# Altium schematic sheet in_board.SchDoc
size A2
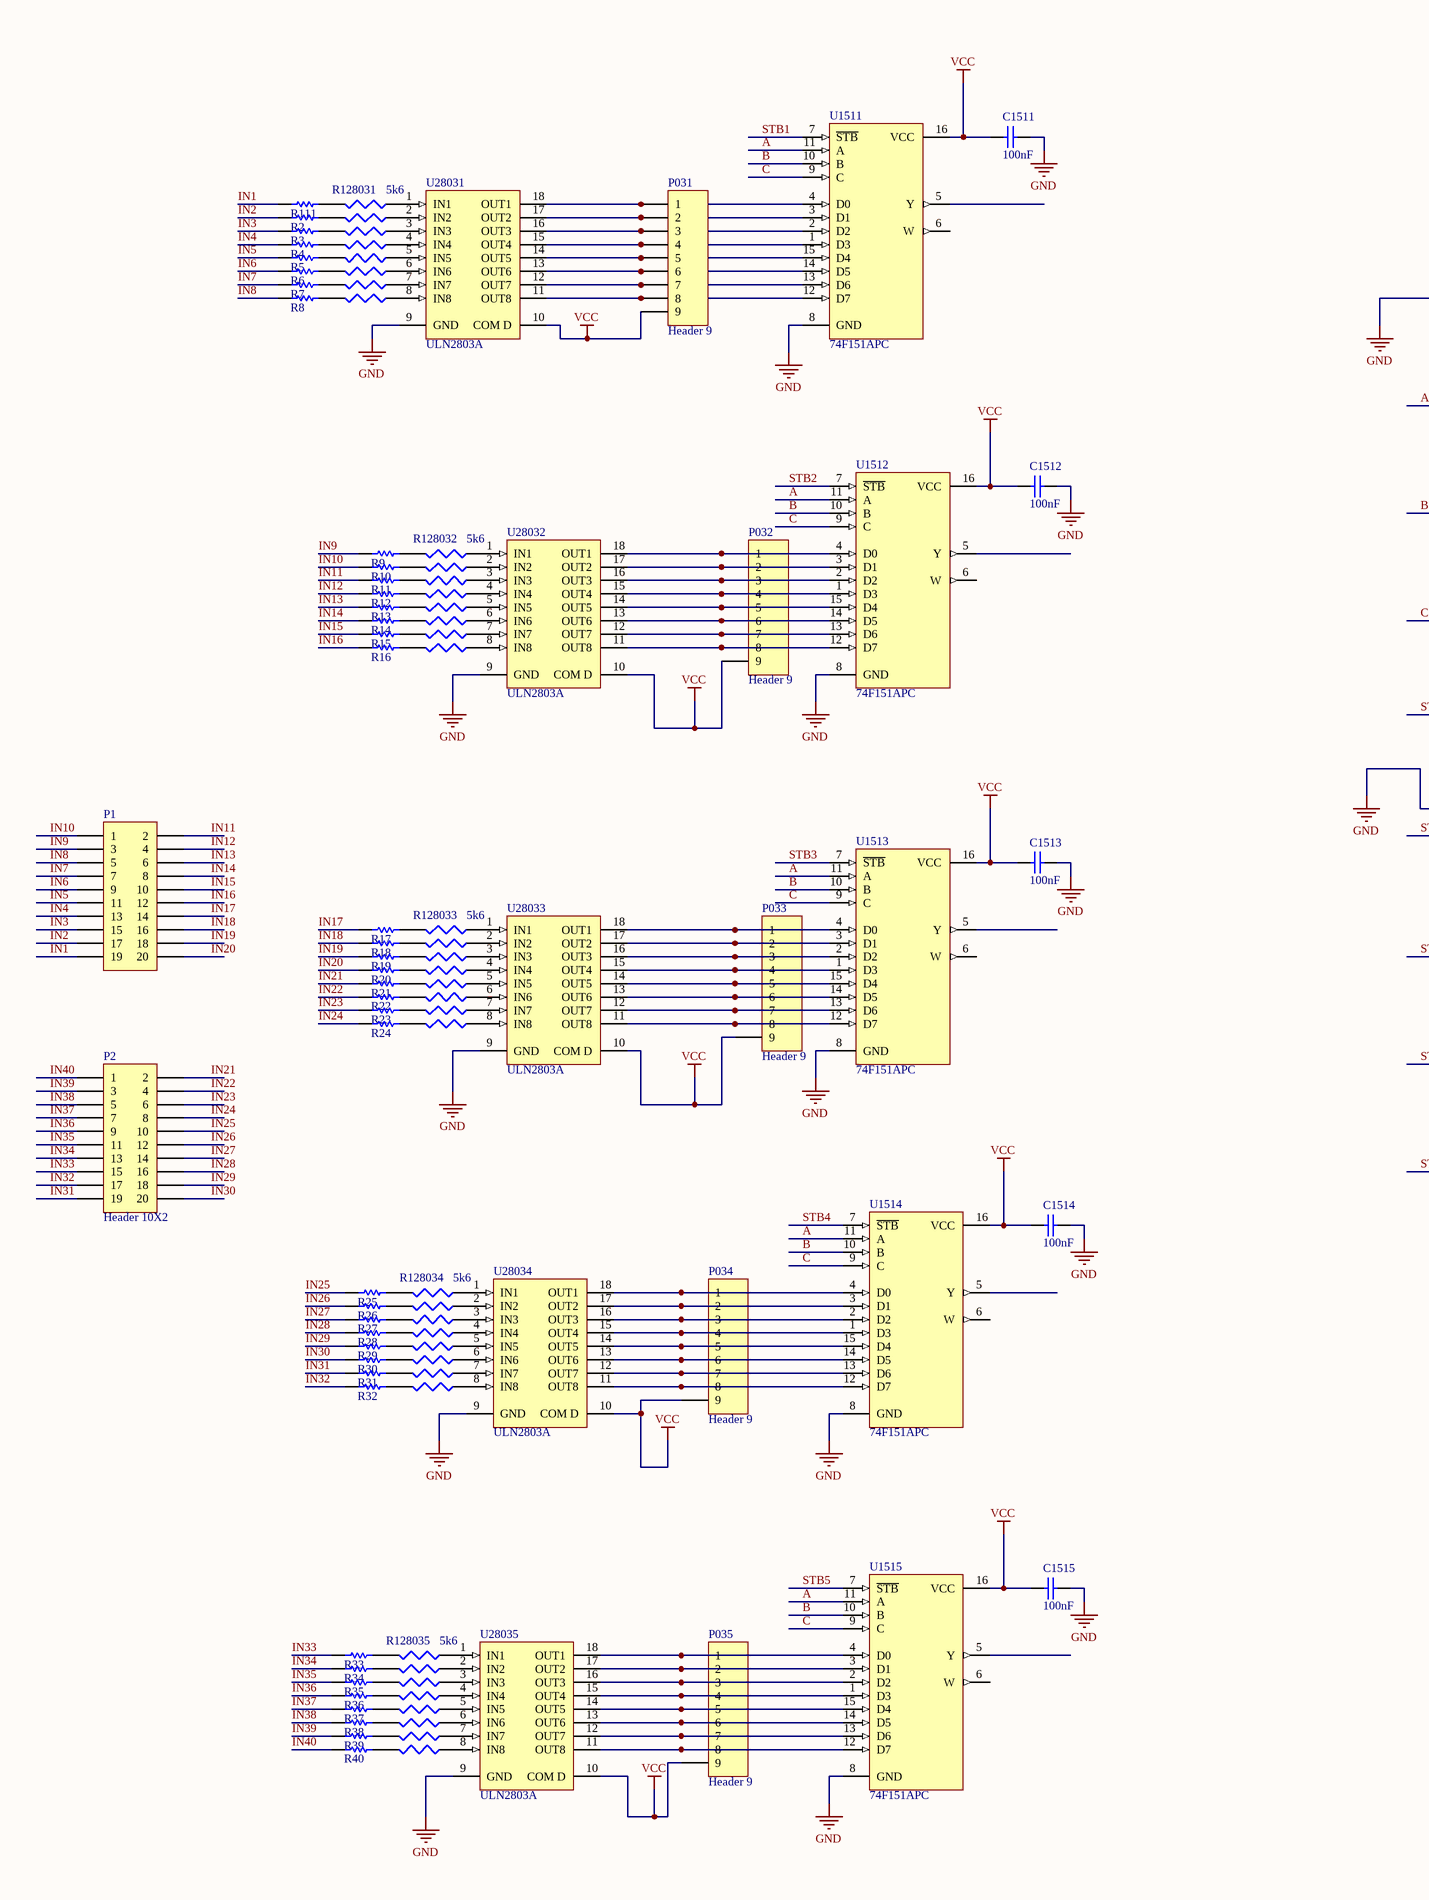
[diagram p0: in_board.SchDoc, left]
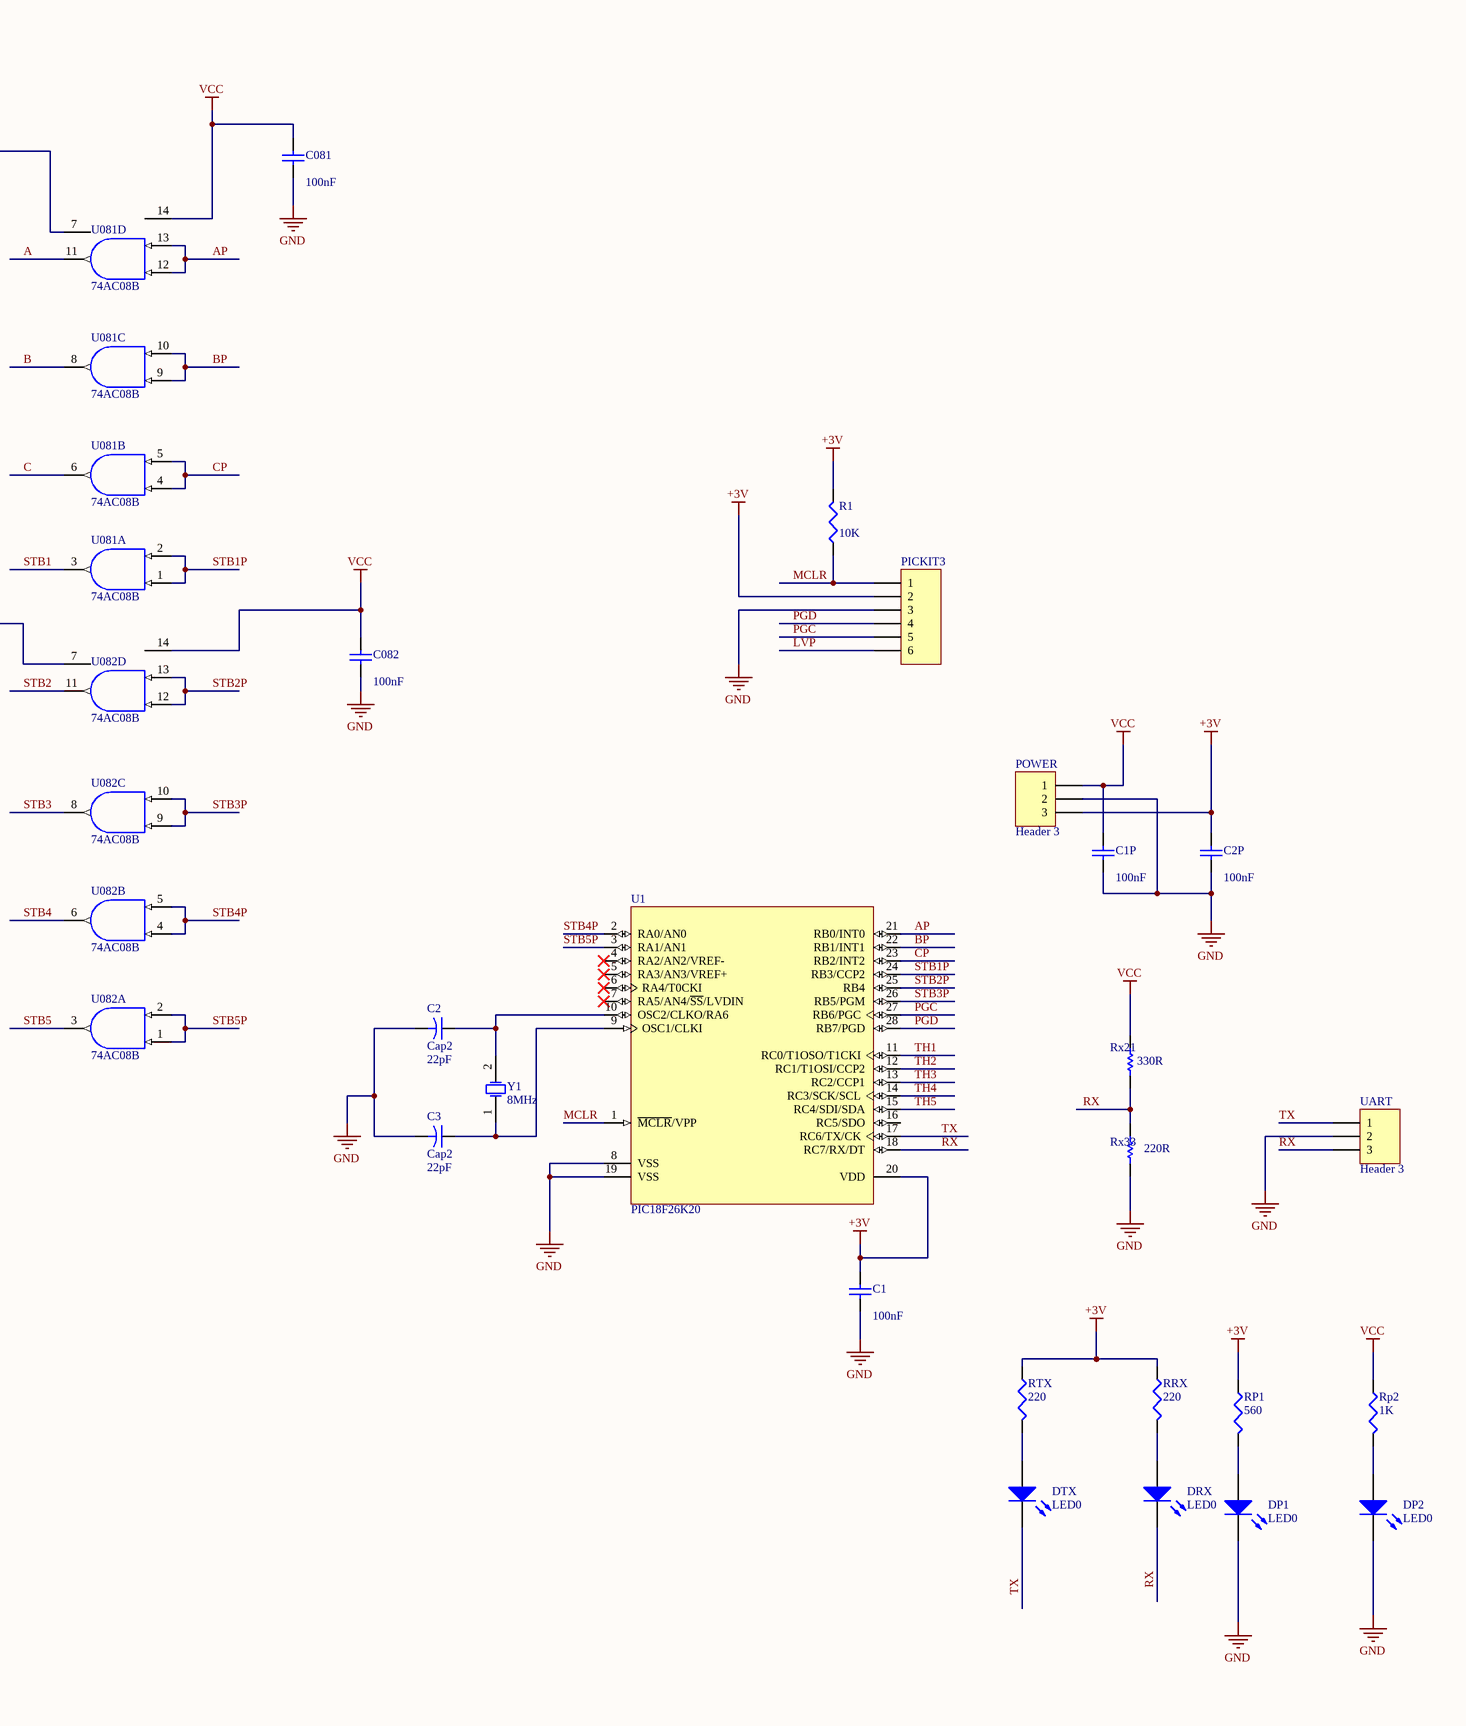
[diagram p1: in_board.SchDoc, right]

## Parts
C1  value 100nF  [tu_gom]  (hidden comment: Cap)
C1P  value 100nF  [tu_gom]  (hidden comment: Cap)
C2  Cap2  value 22pF  [tu_gom]
C2P  value 100nF  [tu_gom]  (hidden comment: Cap)
C3  Cap2  value 22pF  [tu_gom]
C081  value 100nF  [tu_gom]  (hidden comment: Cap)
C082  value 100nF  [tu_gom]  (hidden comment: Cap)
C1511  value 100nF  [tu_gom]  (hidden comment: Cap)
C1512  value 100nF  [tu_gom]  (hidden comment: Cap)
C1513  value 100nF  [tu_gom]  (hidden comment: Cap)
C1514  value 100nF  [tu_gom]  (hidden comment: Cap)
C1515  value 100nF  [tu_gom]  (hidden comment: Cap)
DP1  LED0  [LED_3]
DP2  LED0  [LED_3]
DRX  LED0  [LED_3]
DTX  LED0  [LED_3]
P1  Header 10X2  [HDR2X10]  (value not drawn)
P2  Header 10X2  [HDR2X10]
P031  Header 9  [HDR1X9]
P032  Header 9  [HDR1X9]
P033  Header 9  [HDR1X9]
P034  Header 9  [HDR1X9]
P035  Header 9  [HDR1X9]
PICKIT3  PICKIT3  [HDR1X6]  (value not drawn)
POWER  Header 3  [HEADER3]
R1  value 10K  [R_Nor]  (hidden comment: Res3)
R2  Res  [R_Nor]  (value not drawn)
R3  Res  [R_Nor]  (value not drawn)
R4  Res  [R_Nor]  (value not drawn)
R5  Res  [R_Nor]  (value not drawn)
R6  Res  [R_Nor]  (value not drawn)
R7  Res  [R_Nor]  (value not drawn)
R8  Res  [R_Nor]  (value not drawn)
R9  Res  [R_Nor]  (value not drawn)
R10  Res  [R_Nor]  (value not drawn)
R11  Res  [R_Nor]  (value not drawn)
R12  Res  [R_Nor]  (value not drawn)
R13  Res  [R_Nor]  (value not drawn)
R14  Res  [R_Nor]  (value not drawn)
R15  Res  [R_Nor]  (value not drawn)
R16  Res  [R_Nor]  (value not drawn)
R17  Res  [R_Nor]  (value not drawn)
R18  Res  [R_Nor]  (value not drawn)
R19  Res  [R_Nor]  (value not drawn)
R20  Res  [R_Nor]  (value not drawn)
R21  Res  [R_Nor]  (value not drawn)
R22  Res  [R_Nor]  (value not drawn)
R23  Res  [R_Nor]  (value not drawn)
R24  Res  [R_Nor]  (value not drawn)
R25  Res  [R_Nor]  (value not drawn)
R26  Res  [R_Nor]  (value not drawn)
R27  Res  [R_Nor]  (value not drawn)
R28  Res  [R_Nor]  (value not drawn)
R29  Res  [R_Nor]  (value not drawn)
R30  Res  [R_Nor]  (value not drawn)
R31  Res  [R_Nor]  (value not drawn)
R32  Res  [R_Nor]  (value not drawn)
R33  Res  [R_Nor]  (value not drawn)
R34  Res  [R_Nor]  (value not drawn)
R35  Res  [R_Nor]  (value not drawn)
R36  Res  [R_Nor]  (value not drawn)
R37  Res  [R_Nor]  (value not drawn)
R38  Res  [R_Nor]  (value not drawn)
R39  Res  [R_Nor]  (value not drawn)
R40  Res  [R_Nor]  (value not drawn)
R111  Res  [R_Nor]  (value not drawn)
R42802  Res3  [R_Nor]  (value not drawn)
R42803  Res3  [R_Nor]  (value not drawn)
R42804  Res3  [R_Nor]  (value not drawn)
R128031  value 5k6  [R_Nor]  (hidden comment: Res3)
R128032  value 5k6  [R_Nor]  (hidden comment: Res3)
R128033  value 5k6  [R_Nor]  (hidden comment: Res3)
R128034  value 5k6  [R_Nor]  (hidden comment: Res3)
R128035  value 5k6  [R_Nor]  (hidden comment: Res3)
R228031  Res3  [R_Nor]  (value not drawn)
R228032  Res3  [R_Nor]  (value not drawn)
R228033  Res3  [R_Nor]  (value not drawn)
R228034  Res3  [R_Nor]  (value not drawn)
R228035  Res3  [R_Nor]  (value not drawn)
R328031  Res3  [R_Nor]  (value not drawn)
R328032  Res3  [R_Nor]  (value not drawn)
R328033  Res3  [R_Nor]  (value not drawn)
R328034  Res3  [R_Nor]  (value not drawn)
R328035  Res3  [R_Nor]  (value not drawn)
R428031  Res3  [R_Nor]  (value not drawn)
R428035  Res3  [R_Nor]  (value not drawn)
R528031  Res3  [R_Nor]  (value not drawn)
R528032  Res3  [R_Nor]  (value not drawn)
R528033  Res3  [R_Nor]  (value not drawn)
R528034  Res3  [R_Nor]  (value not drawn)
R528035  Res3  [R_Nor]  (value not drawn)
R628031  Res3  [R_Nor]  (value not drawn)
R628032  Res3  [R_Nor]  (value not drawn)
R628033  Res3  [R_Nor]  (value not drawn)
R628034  Res3  [R_Nor]  (value not drawn)
R628035  Res3  [R_Nor]  (value not drawn)
R728031  Res3  [R_Nor]  (value not drawn)
R728032  Res3  [R_Nor]  (value not drawn)
R728033  Res3  [R_Nor]  (value not drawn)
R728034  Res3  [R_Nor]  (value not drawn)
R728035  Res3  [R_Nor]  (value not drawn)
R828031  Res3  [R_Nor]  (value not drawn)
R828032  Res3  [R_Nor]  (value not drawn)
R828033  Res3  [R_Nor]  (value not drawn)
R828034  Res3  [R_Nor]  (value not drawn)
R828035  Res3  [R_Nor]  (value not drawn)
RP1  value 560  [R_Nor]  (hidden comment: Res3)
Rp2  value 1K  [R_Nor]  (hidden comment: Res3)
RRX  value 220  [R_Nor]  (hidden comment: Res3)
RTX  value 220  [R_Nor]  (hidden comment: Res3)
Rx21  330R  [R_Nor]
Rx33  220R  [R_Nor]
U1  PIC18F26K20  [SOIC300-28_N]
U081  74AC08B  [DIP14]  (parts A,B,C,D of 4)
U082  74AC08B  [DIP14]  (parts A,B,C,D of 4)
U1511  74F151APC  [N16E]
U1512  74F151APC  [N16E]
U1513  74F151APC  [N16E]
U1514  74F151APC  [N16E]
U1515  74F151APC  [N16E]
U28031  ULN2803A  [DIP18]
U28032  ULN2803A  [DIP18]
U28033  ULN2803A  [DIP18]
U28034  ULN2803A  [DIP18]
U28035  ULN2803A  [DIP18]
UART  Header 3  [Coc3_15A]
Y1  8MHz  [Xtal12M]

## Nets
+3V: C1.1 C2P.1 PICKIT3.2 POWER.3 R1.2 RP1.1 RRX.1 RTX.1 U1.20(VDD)
GND: C1.2 C1P.2 C2.2 C2P.2 C3.2 C081.2 C082.2 C1511.2 C1512.2 C1513.2 C1514.2 C1515.2 DP1.2(K) DP2.2(K) PICKIT3.3 POWER.2 Rx33.1 U1.8(VSS) U1.19(VSS) U081.7(GND) U082.7(GND) U1511.8(GND) U1512.8(GND) U1513.8(GND) U1514.8(GND) U1515.8(GND) U28031.9(GND) U28032.9(GND) U28033.9(GND) U28034.9(GND) U28035.9(GND) UART.2
VCC: C1P.1 C081.1 C082.1 C1511.1 C1512.1 C1513.1 C1514.1 C1515.1 P031.9 P032.9 P033.9 P034.9 P035.9 POWER.1 Rp2.1 Rx21.2 U081.14(VCC) U082.14(VCC) U1511.16(VCC) U1512.16(VCC) U1513.16(VCC) U1514.16(VCC) U1515.16(VCC) U28031.10(COM_D) U28032.10(COM_D) U28033.10(COM_D) U28034.10(COM_D) U28035.10(COM_D)
A: U081.11(Y) U1511.11(A) U1512.11(A) U1513.11(A) U1514.11(A) U1515.11(A)
AP: U1.21(RB0/INT0) U081.12(A) U081.13(B)
B: U081.8(Y) U1511.10(B) U1512.10(B) U1513.10(B) U1514.10(B) U1515.10(B)
BP: U1.22(RB1/INT1) U081.9(A) U081.10(B)
C: U081.6(Y) U1511.9(C) U1512.9(C) U1513.9(C) U1514.9(C) U1515.9(C)
CP: U1.23(RB2/INT2) U081.4(A) U081.5(B)
IN1: P1.19 R111.1
IN2: P1.17 R2.1
IN3: P1.15 R3.1
IN4: P1.13 R4.1
IN5: P1.11 R5.1
IN6: P1.9 R6.1
IN7: P1.7 R7.1
IN8: P1.5 R8.1
IN9: P1.3 R9.1
IN10: P1.1 R10.1
IN11: P1.2 R11.1
IN12: P1.4 R12.1
IN13: P1.6 R13.1
IN14: P1.8 R14.1
IN15: P1.10 R15.1
IN16: P1.12 R16.1
IN17: P1.14 R17.1
IN18: P1.16 R18.1
IN19: P1.18 R19.1
IN20: P1.20 R20.1
IN21: P2.2 R21.1
IN22: P2.4 R22.1
IN23: P2.6 R23.1
IN24: P2.8 R24.1
IN25: P2.10 R25.1
IN26: P2.12 R26.1
IN27: P2.14 R27.1
IN28: P2.16 R28.1
IN29: P2.18 R29.1
IN30: P2.20 R30.1
IN31: P2.19 R31.1
IN32: P2.17 R32.1
IN33: P2.15 R33.1
IN34: P2.13 R34.1
IN35: P2.11 R35.1
IN36: P2.9 R36.1
IN37: P2.7 R37.1
IN38: P2.5 R38.1
IN39: P2.3 R39.1
IN40: P2.1 R40.1
LVP: PICKIT3.6
MCLR: PICKIT3.1 R1.1 U1.1(~{MCLR}/VPP)
PGC: PICKIT3.5 U1.27(RB6/PGC)
PGD: PICKIT3.4 U1.28(RB7/PGD)
RX: DRX.2(K) Rx21.1 Rx33.2 U1.18(RC7/RX/DT) UART.3
STB1: U081.3(Y) U1511.7(~{STB})
STB1P: U1.24(RB3/CCP2) U081.1(A) U081.2(B)
STB2: U082.11(Y) U1512.7(~{STB})
STB2P: U1.25(RB4) U082.12(A) U082.13(B)
STB3: U082.8(Y) U1513.7(~{STB})
STB3P: U1.26(RB5/PGM) U082.9(A) U082.10(B)
STB4: U082.6(Y) U1514.7(~{STB})
STB4P: U1.2(RA0/AN0) U082.4(A) U082.5(B)
STB5: U082.3(Y) U1515.7(~{STB})
STB5P: U1.3(RA1/AN1) U082.1(A) U082.2(B)
TH1: U1.11(RC0/T1OSO/T1CKI)
TH2: U1.12(RC1/T1OSI/CCP2)
TH3: U1.13(RC2/CCP1)
TH4: U1.14(RC3/SCK/SCL)
TH5: U1.15(RC4/SDI/SDA)
TX: DTX.2(K) U1.17(RC6/TX/CK) UART.1
NetC2_1: C2.1 U1.10(OSC2/CLKO/RA6) Y1.2(OSC2)
NetC3_1: C3.1 U1.9(OSC1/CLKI) Y1.1(OSC1)
NetDP1_1: DP1.1(A) RP1.2
NetDP2_1: DP2.1(A) Rp2.2
NetDRX_1: DRX.1(A) RRX.2
NetDTX_1: DTX.1(A) RTX.2
NetP031_1: P031.1 U1511.4(D0) U28031.18(OUT1)
NetP031_2: P031.2 U1511.3(D1) U28031.17(OUT2)
NetP031_3: P031.3 U1511.2(D2) U28031.16(OUT3)
NetP031_4: P031.4 U1511.1(D3) U28031.15(OUT4)
NetP031_5: P031.5 U1511.15(D4) U28031.14(OUT5)
NetP031_6: P031.6 U1511.14(D5) U28031.13(OUT6)
NetP031_7: P031.7 U1511.13(D6) U28031.12(OUT7)
NetP031_8: P031.8 U1511.12(D7) U28031.11(OUT8)
NetP032_1: P032.1 U1512.4(D0) U28032.18(OUT1)
NetP032_2: P032.2 U1512.3(D1) U28032.17(OUT2)
NetP032_3: P032.3 U1512.2(D2) U28032.16(OUT3)
NetP032_4: P032.4 U1512.1(D3) U28032.15(OUT4)
NetP032_5: P032.5 U1512.15(D4) U28032.14(OUT5)
NetP032_6: P032.6 U1512.14(D5) U28032.13(OUT6)
NetP032_7: P032.7 U1512.13(D6) U28032.12(OUT7)
NetP032_8: P032.8 U1512.12(D7) U28032.11(OUT8)
NetP033_1: P033.1 U1513.4(D0) U28033.18(OUT1)
NetP033_2: P033.2 U1513.3(D1) U28033.17(OUT2)
NetP033_3: P033.3 U1513.2(D2) U28033.16(OUT3)
NetP033_4: P033.4 U1513.1(D3) U28033.15(OUT4)
NetP033_5: P033.5 U1513.15(D4) U28033.14(OUT5)
NetP033_6: P033.6 U1513.14(D5) U28033.13(OUT6)
NetP033_7: P033.7 U1513.13(D6) U28033.12(OUT7)
NetP033_8: P033.8 U1513.12(D7) U28033.11(OUT8)
NetP034_1: P034.1 U1514.4(D0) U28034.18(OUT1)
NetP034_2: P034.2 U1514.3(D1) U28034.17(OUT2)
NetP034_3: P034.3 U1514.2(D2) U28034.16(OUT3)
NetP034_4: P034.4 U1514.1(D3) U28034.15(OUT4)
NetP034_5: P034.5 U1514.15(D4) U28034.14(OUT5)
NetP034_6: P034.6 U1514.14(D5) U28034.13(OUT6)
NetP034_7: P034.7 U1514.13(D6) U28034.12(OUT7)
NetP034_8: P034.8 U1514.12(D7) U28034.11(OUT8)
NetP035_1: P035.1 U1515.4(D0) U28035.18(OUT1)
NetP035_2: P035.2 U1515.3(D1) U28035.17(OUT2)
NetP035_3: P035.3 U1515.2(D2) U28035.16(OUT3)
NetP035_4: P035.4 U1515.1(D3) U28035.15(OUT4)
NetP035_5: P035.5 U1515.15(D4) U28035.14(OUT5)
NetP035_6: P035.6 U1515.14(D5) U28035.13(OUT6)
NetP035_7: P035.7 U1515.13(D6) U28035.12(OUT7)
NetP035_8: P035.8 U1515.12(D7) U28035.11(OUT8)
NetR2_2: R2.2 R228031.2
NetR3_2: R3.2 R328031.2
NetR4_2: R4.2 R428031.2
NetR5_2: R5.2 R528031.2
NetR6_2: R6.2 R628031.2
NetR7_2: R7.2 R728031.2
NetR8_2: R8.2 R828031.2
NetR9_2: R9.2 R128032.2
NetR10_2: R10.2 R228032.2
NetR11_2: R11.2 R328032.2
NetR12_2: R12.2 R42802.2
NetR13_2: R13.2 R528032.2
NetR14_2: R14.2 R628032.2
NetR15_2: R15.2 R728032.2
NetR16_2: R16.2 R828032.2
NetR17_2: R17.2 R128033.2
NetR18_2: R18.2 R228033.2
NetR19_2: R19.2 R328033.2
NetR20_2: R20.2 R42803.2
NetR21_2: R21.2 R528033.2
NetR22_2: R22.2 R628033.2
NetR23_2: R23.2 R728033.2
NetR24_2: R24.2 R828033.2
NetR25_2: R25.2 R128034.2
NetR26_2: R26.2 R228034.2
NetR27_2: R27.2 R328034.2
NetR28_2: R28.2 R42804.2
NetR29_2: R29.2 R528034.2
NetR30_2: R30.2 R628034.2
NetR31_2: R31.2 R728034.2
NetR32_2: R32.2 R828034.2
NetR33_2: R33.2 R128035.2
NetR34_2: R34.2 R228035.2
NetR35_2: R35.2 R328035.2
NetR36_2: R36.2 R428035.2
NetR37_2: R37.2 R528035.2
NetR38_2: R38.2 R628035.2
NetR39_2: R39.2 R728035.2
NetR40_2: R40.2 R828035.2
NetR111_2: R111.2 R128031.2
NetR42802_1: R42802.1 U28032.4(IN4)
NetR42803_1: R42803.1 U28033.4(IN4)
NetR42804_1: R42804.1 U28034.4(IN4)
NetR128031_1: R128031.1 U28031.1(IN1)
NetR128032_1: R128032.1 U28032.1(IN1)
NetR128033_1: R128033.1 U28033.1(IN1)
NetR128034_1: R128034.1 U28034.1(IN1)
NetR128035_1: R128035.1 U28035.1(IN1)
NetR228031_1: R228031.1 U28031.2(IN2)
NetR228032_1: R228032.1 U28032.2(IN2)
NetR228033_1: R228033.1 U28033.2(IN2)
NetR228034_1: R228034.1 U28034.2(IN2)
NetR228035_1: R228035.1 U28035.2(IN2)
NetR328031_1: R328031.1 U28031.3(IN3)
NetR328032_1: R328032.1 U28032.3(IN3)
NetR328033_1: R328033.1 U28033.3(IN3)
NetR328034_1: R328034.1 U28034.3(IN3)
NetR328035_1: R328035.1 U28035.3(IN3)
NetR428031_1: R428031.1 U28031.4(IN4)
NetR428035_1: R428035.1 U28035.4(IN4)
NetR528031_1: R528031.1 U28031.5(IN5)
NetR528032_1: R528032.1 U28032.5(IN5)
NetR528033_1: R528033.1 U28033.5(IN5)
NetR528034_1: R528034.1 U28034.5(IN5)
NetR528035_1: R528035.1 U28035.5(IN5)
NetR628031_1: R628031.1 U28031.6(IN6)
NetR628032_1: R628032.1 U28032.6(IN6)
NetR628033_1: R628033.1 U28033.6(IN6)
NetR628034_1: R628034.1 U28034.6(IN6)
NetR628035_1: R628035.1 U28035.6(IN6)
NetR728031_1: R728031.1 U28031.7(IN7)
NetR728032_1: R728032.1 U28032.7(IN7)
NetR728033_1: R728033.1 U28033.7(IN7)
NetR728034_1: R728034.1 U28034.7(IN7)
NetR728035_1: R728035.1 U28035.7(IN7)
NetR828031_1: R828031.1 U28031.8(IN8)
NetR828032_1: R828032.1 U28032.8(IN8)
NetR828033_1: R828033.1 U28033.8(IN8)
NetR828034_1: R828034.1 U28034.8(IN8)
NetR828035_1: R828035.1 U28035.8(IN8)

Not connected (* = marked no-connect by the designer): U1 4(RA2/AN2/VREF-)* 5(RA3/AN3/VREF+)* 6(RA4/T0CKI)* 7(RA5/AN4/~{SS}/LVDIN)* 16(RC5/SDO); U1511 5(Y) 6(W); U1512 5(Y) 6(W); U1513 5(Y) 6(W); U1514 5(Y) 6(W); U1515 5(Y) 6(W)

## Library data of the parts
C1 C1P C2P C081 C082 C1511-C1515 = Cap: Capacitor; Published: 8-Jun-2000; LatestRevisionDate: 17-Jul-2002; LatestRevisionNote: Re-released for DXP Platform.; PackageReference: RAD-0.3; Publisher: Altium Limited
C2 C3 = Cap2: Capacitor; Published: 23-Sep-2002; PackageReference: CAPR5-4X5; Publisher: Altium Limited
DP1 DP2 DRX DTX = LED0: Typical INFRARED GaAs LED; Published: 8-Jun-2000; LatestRevisionDate: 08-Jul-2005; LatestRevisionNote: Mech Layer 1 removed.; PackageReference: LED-0; Publisher: Altium Limited
P1 P2 = Header 10X2: Header, 10-Pin, Dual row; LatestRevisionDate: 17-Jul-2002; LatestRevisionNote: Re-released for DXP Platform.; Publisher: Altium Limited
P031 P032 P033 P034 P035 = Header 9: Header, 9-Pin; LatestRevisionDate: 17-Jul-2002; LatestRevisionNote: Re-released for DXP Platform.; Publisher: Altium Limited
PICKIT3 = Header 6: Header, 6-Pin; LatestRevisionDate: 17-Jul-2002; LatestRevisionNote: Re-released for DXP Platform.; Publisher: Altium Limited
POWER UART = Header 3: Header, 3-Pin; LatestRevisionDate: 17-Jul-2002; LatestRevisionNote: Re-released for DXP Platform.; Publisher: Altium Limited
R1 R128031-R128035 RP1 Rp2 RRX RTX = Res3: Resistor; Published: 8-Jun-2000; LatestRevisionDate: 04-Mar-2005; LatestRevisionNote: PCB Footprint replaced.; PackageReference: J1-0603; Publisher: Altium Limited
R42802 R42804 R228031-R228035 R328031-R328035 R428031 R428035 R528031-R528035 R628031-R628035 R728031-R728035 R828031-R828035 = Res3: Resistor; Value: 560; Published: 8-Jun-2000; LatestRevisionDate: 04-Mar-2005; LatestRevisionNote: PCB Footprint replaced.; PackageReference: J1-0603; Publisher: Altium Limited
R42803 = Res3: Resistor; Value: 1k; Published: 8-Jun-2000; LatestRevisionDate: 04-Mar-2005; LatestRevisionNote: PCB Footprint replaced.; PackageReference: J1-0603; Publisher: Altium Limited
Rx21 Rx33 = Res
U1 = PIC18F242-E/SO: High Performance, Enhanced FLASH Microcontroller with 10-Bit A/D, 16K FLASH, 28-Pin SOIC, Standard Volt Range, Extended Temperature; Note: RB3 is the alternate pin for the CCP2 pin multiplexing.; Published: 11-Oct-2004; LatestRevisionDate: 13-Apr-2006; LatestRevisionNote: IPC-7351 Footprint Added.; DatasheetVersion: DS39564B_2002; PackageVersion: 2005; PackageReference: SOIC300-28; Publisher: Altium Limited; PackageDescription: 28-Pin Small Outline Integrated Circuit 1.27 mm Pitch; Code_JEDEC: MS-013; ComponentLink1Description: Manufacturer Link; ComponentLink1URL: http://www.microchip.com; ComponentLink2Description: Datasheet; ComponentLink2URL: http://ww1.microchip.com/downloads/en/DeviceDoc/39564b.pdf; ComponentLink3Description: Packaging Specification; ComponentLink3URL: http://ww1.microchip.com/downloads/en/PackagingSpec/00049AD.pdf
U081 U082 = 74AC08B: Quad 2-Input AND Gate; Published: 8-Jun-2000; LatestRevisionDate: 06-Jun-2005; LatestRevisionNote: Stylized 3D Model Added.; DatasheetVersion: Apr-1997; PackageVersion: Jan-1997; PackageReference: DIP14; Publisher: Altium Limited; PackageDescription: DIP; 14 Leads; Row Spacing 7.62 mm; Pitch 2.54 mm; ComponentLink1Description: Manufacturer Link; ComponentLink1URL: http://www.st.com/; ComponentLink2Description: Datasheet; ComponentLink2URL: http://www.st.com/stonline/products/literature/ds/4694/74ac08.pdf
U1511-U1515 = 74F151APC: 8-Input Multiplexer; Published: 15-Apr-2002; LatestRevisionDate: 06-Jun-2005; LatestRevisionNote: Stylized 3D Model Added.; DatasheetVersion: Nov-1994; PackageVersion: 2000; PackageReference: N16E; Publisher: Altium Limited; PackageDescription: DIP; 16 Leads; Row Spacing 7.62 mm; Pitch 2.54 mm; ComponentLink1Description: Manufacturer Link; ComponentLink1URL: http://www.national.com/; ComponentLink2Description: Datasheet; ComponentLink2URL: http://www.fairchildsemi.com/ds/74/74F151A.pdf; ComponentLink3Description: URL Link1; ComponentLink3URL: http://www.fairchildsemi.com/pf/74/74F151A.html
U28031-U28035 = ULN2803A: Eight Darlington Array; Published: 8-Jun-2000; LatestRevisionDate: 06-Jun-2005; LatestRevisionNote: Stylized 3D Model Added.; DatasheetVersion: Sep-1997; PackageReference: DIP18; Publisher: Altium Limited; PackageDescription: DIP; 18 Leads; Row Spacing 7.62 mm; Pitch 2.54 mm; ComponentLink1Description: Manufacturer Link; ComponentLink1URL: http://www.st.com/; ComponentLink2Description: Datasheet; ComponentLink2URL: http://www.st.com/stonline/products/literature/ds/1536/uln2801a.pdf
Y1 = XTAL: Crystal Oscillator; Published: 8-Jun-2000; LatestRevisionDate: 17-Jul-2002; LatestRevisionNote: Re-released for DXP Platform.; PackageReference: R38; Publisher: Altium Limited